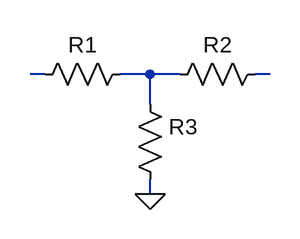
[diagram p0: schematic Red T.asc]
Red T.asc, the LTspice schematic file:
Version 4
SHEET 1 1708 680
WIRE 720 -304 704 -304
WIRE 832 -304 800 -304
WIRE 864 -304 832 -304
WIRE 960 -304 944 -304
WIRE 832 -272 832 -304
WIRE 832 -176 832 -192
FLAG 832 -176 0
SYMBOL res 816 -288 R0
SYMATTR InstName R3
SYMATTR Value ""
SYMBOL res 704 -288 R270
WINDOW 0 32 56 VTop 2
WINDOW 3 0 56 VBottom 2
SYMATTR InstName R1
SYMATTR Value ""
SYMBOL res 848 -288 R270
WINDOW 0 32 56 VTop 2
WINDOW 3 0 56 VBottom 2
SYMATTR InstName R2
SYMATTR Value ""

The netlist it stands for:
* Red T.asc
R3 N002 0
R1 N001 N002
R2 N002 N003
.backanno
.end